# Altium schematic sheet [4] Sensors.SchDoc
size A
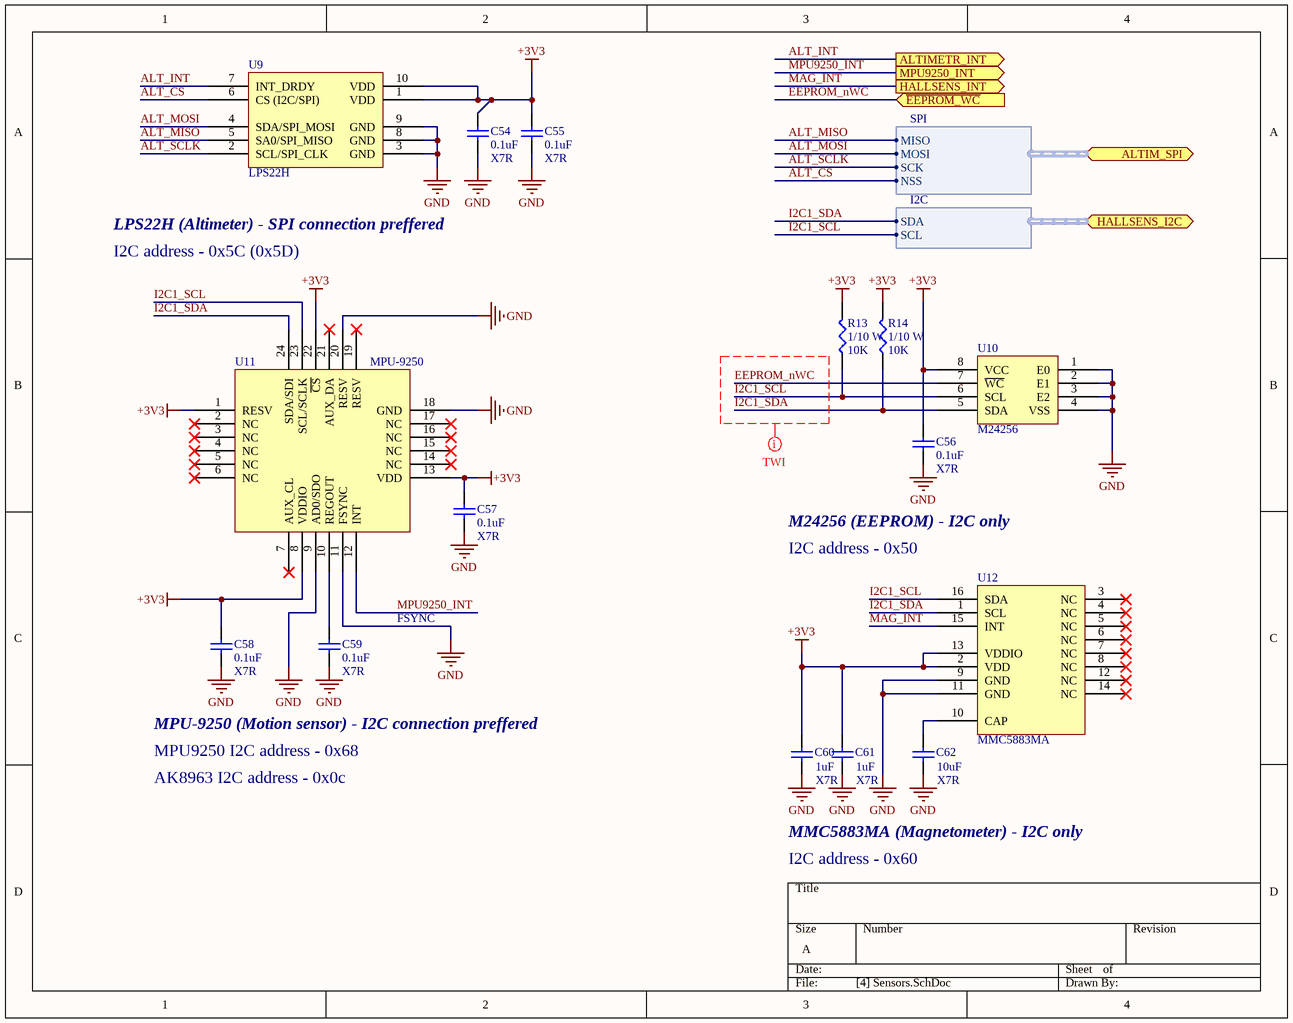
[diagram p0: [4] Sensors.SchDoc]

## Parts
C54  value 0.1uF  Type: X7R  [CAP0402]  (hidden comment: ChipCap 0.1u X7R)
C55  value 0.1uF  Type: X7R  [CAP0402]  (hidden comment: ChipCap 0.1u X7R)
C56  value 0.1uF  Type: X7R  [CAP0603]  (hidden comment: ChipCap 0.1u X7R)
C57  value 0.1uF  Type: X7R  [CAP0603]  (hidden comment: ChipCap 0.1u X7R)
C58  value 0.1uF  Type: X7R  [CAP0603]  (hidden comment: ChipCap 0.1u X7R)
C59  value 0.1uF  Type: X7R  [CAP0603]  (hidden comment: ChipCap 0.1u X7R)
C60  value 1uF  Type: X7R  [CAP0603]  (hidden comment: ChipCap 1u X7R)
C61  value 1uF  Type: X7R  [CAP0603]  (hidden comment: ChipCap 1u X7R)
C62  value 10uF  Type: X7R  [CAP0805]  (hidden comment: ChipCap 10u X7R)
R13  value 10K  Rating: 1/10 W  [RES0805]  (hidden comment: ChipRes 10K 1%)
R14  value 10K  Rating: 1/10 W  [RES0805]  (hidden comment: ChipRes 10K 1%)
U9  LPS22H  [HLGA-10L]
U10  M24256  [SOIC8]
U11  MPU-9250  [QFN24]
U12  MMC5883MA  [LGA16]

## Ports
ALTIM_SPI (harness SPI), ALTIMETR_INT (out), HALLSENS_I2C (harness I2C), HALLSENS_INT (out), MPU9250_INT (out), ~{EEPROM_WC} (in)

## Harnesses
SPI: MISO, MOSI, SCK, NSS
I2C: SDA, SCL

## Nets
+3V3: C54.2 C55.2 C56.2 C57.2 C58.2 C60.2 C61.2 R13.2 R14.2 U9.1(VDD) U9.10(VDD) U10.8(VCC) U11.1(RESV) U11.8(VDDIO) U11.13(VDD) U11.22(~{CS}) U12.2(VDD) U12.13(VDDIO)
GND: C54.1 C55.1 C56.1 C57.1 C58.1 C59.1 C60.1 C61.1 C62.1 U9.3(GND) U9.8(GND) U9.9(GND) U10.1(E0) U10.2(E1) U10.3(E2) U10.4(VSS) U11.9(AD0/SDO) U11.11(FSYNC) U11.18(GND) U11.20(RESV) U12.9(GND) U12.11(GND)
ALT_CS: U9.6(CS_(I2C/SPI)) ; port ALTIM_SPI.NSS
ALT_INT: U9.7(INT_DRDY) ; port ALTIMETR_INT
ALT_MISO: U9.5(SA0/SPI_MISO) ; port ALTIM_SPI.MISO
ALT_MOSI: U9.4(SDA/SPI_MOSI) ; port ALTIM_SPI.MOSI
ALT_SCLK: U9.2(SCL/SPI_CLK) ; port ALTIM_SPI.SCK
EEPROM_nWC: U10.7(~{WC}) ; port ~{EEPROM_WC}
I2C1_SCL: R13.1 U10.6(SCL) U11.23(SCL/SCLK) U12.16(SDA) ; port HALLSENS_I2C.SCL
I2C1_SDA: R14.1 U10.5(SDA) U11.24(SDA/SDI) U12.1(SCL) ; port HALLSENS_I2C.SDA
MAG_INT: U12.15(INT) ; port HALLSENS_INT
MPU9250_INT: U11.12(INT) ; port MPU9250_INT
NetC59_2: C59.2 U11.10(REGOUT)
NetC62_2: C62.2 U12.10(CAP)

Not connected (* = marked no-connect by the designer): U11 2(NC)* 3(NC)* 4(NC)* 5(NC)* 6(NC)* 7(AUX_CL)* 14(NC)* 15(NC)* 16(NC)* 17(NC)* 19(RESV)* 21(AUX_DA)*; U12 3(NC)* 4(NC)* 5(NC)* 6(NC)* 7(NC)* 8(NC)* 12(NC)* 14(NC)*

## Layout directives
net class TWI: EEPROM_nWC, I2C1_SCL, I2C1_SDA

## Notes on the sheet
- LPS22H (Altimeter) - SPI connection preffered
- I2C address - 0x5C (0x5D)
- M24256 (EEPROM) - I2C only
- I2C address - 0x50
- FSYNC
- MPU-9250 (Motion sensor) - I2C connection preffered
- MPU9250 I2C address - 0x68
- AK8963 I2C address - 0x0c
- MMC5883MA (Magnetometer) - I2C only
- I2C address - 0x60

## Library data of the parts
C54-C59 = ChipCap 0.1uF X7R: Surface-mount ceramic multilayer capacitor; Manufacturer: YAGEO; Voltage: 100V; Tolerance: 10%; ComponentLink1Description: Datasheet; ComponentLink1URL: http://www.deaha.com/pdf/YAGEO-CC_series.pdf
C60 C61 = ChipCap 1uF X7R: Surface-mount ceramic multilayer capacitor; Manufacturer: YAGEO; Voltage: 25V; Tolerance: 10%; ComponentLink1Description: Datasheet; ComponentLink1URL: http://www.deaha.com/pdf/YAGEO-CC_series.pdf
C62 = ChipCap 10uF X7R: Surface-mount ceramic multilayer capacitor; Manufacturer: YAGEO; Voltage: 25V; Tolerance: 10%; ComponentLink1Description: Datasheet; ComponentLink1URL: http://www.deaha.com/pdf/YAGEO-CC_series.pdf
R13 R14 = ChipRes 10K 1%: Think Film Chip resistor; Temperature Coefficient: 200ppm/K; Tolerance: 1%; Type: ThickFilm
U9 = LPS22H: MEMS nano pressure sensor: 260-1260 hPa
U10 = M24256: 256 Kbit I2C EEPROM
U11 = MPU-9250: 9-Axis sensor
U12 = MMC5883MA: 3-axis Magnetic Sensor